# Altium schematic sheet schematic_flashlight.SchDoc
size A; SheetNumber: 1; SheetTotal: 1
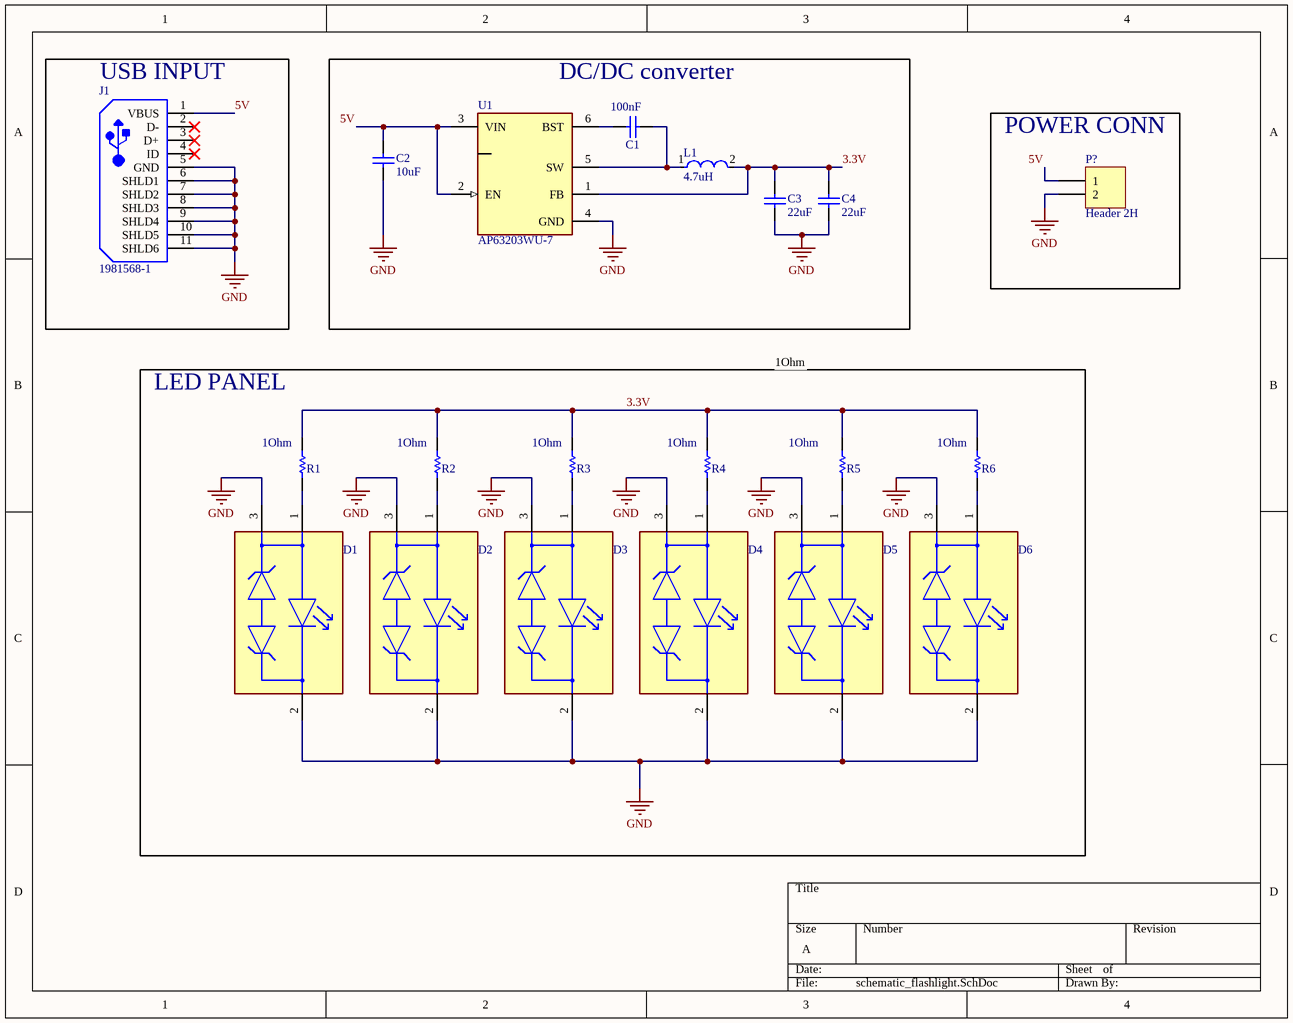
[diagram p0: schematic_flashlight.SchDoc]

## Parts
C1  100nF  [CAPC2013X145X50LL20T25]
C2  10uF  [CAPC2013X145X50LL20T25]
C3  22uF  [CAPC2013X145X50LL20T25]
C4  22uF  [CAPC2013X145X50LL20T25]
D1  SML-LXL8047USBCTR3  [FP-SML-LXL8047USBCTR3-MFG]  (value not drawn)
D2  SML-LXL8047USBCTR3  [FP-SML-LXL8047USBCTR3-MFG]  (value not drawn)
D3  SML-LXL8047USBCTR3  [FP-SML-LXL8047USBCTR3-MFG]  (value not drawn)
D4  SML-LXL8047USBCTR3  [FP-SML-LXL8047USBCTR3-MFG]  (value not drawn)
D5  SML-LXL8047USBCTR3  [FP-SML-LXL8047USBCTR3-MFG]  (value not drawn)
D6  SML-LXL8047USBCTR3  [FP-SML-LXL8047USBCTR3-MFG]  (value not drawn)
J1  1981568-1  [TECO-1981568-5_V]
L1  4.7uH  [FP-NR6028-MFG]
P?  Header 2H  [HDR1X2H]
R1  1Ohm  [RESC3216X60X45LL10T20]
R2  1Ohm  [RESC3216X60X45LL10T20]
R3  1Ohm  [RESC3216X60X45LL10T20]
R4  1Ohm  [RESC3216X60X45LL10T20]
R5  1Ohm  [RESC3216X60X45LL10T20]
R6  1Ohm  [RESC3216X60X45LL10T20]
U1  AP63203WU-7  [FP-TSOT26-MFG]

## Blocks framed on the sheet
USB INPUT: J1
DC/DC converter: C1-C4 L1 U1
POWER CONN: P?
LED PANEL: D1-D6 R1-R6

## Nets
GND: C2.1 C3.1 C4.1 D1.2(C) D1.3(SLUG) D2.2(C) D2.3(SLUG) D3.2(C) D3.3(SLUG) D4.2(C) D4.3(SLUG) D5.2(C) D5.3(SLUG) D6.2(C) D6.3(SLUG) J1.5(GND) J1.6(SHLD1) J1.7(SHLD2) J1.8(SHLD3) J1.9(SHLD4) J1.10(SHLD5) J1.11(SHLD6) P?.2 U1.4(GND)
3.3V: C3.2 C4.2 L1.2 R1.2 R2.2 R3.2 R4.2 R5.2 R6.2 U1.1(FB)
5V: C2.2 J1.1(VBUS) P?.1 U1.2(EN) U1.3(VIN)
NetC1_1: C1.1 L1.1 U1.5(SW)
NetC1_2: C1.2 U1.6(BST)
NetD1_1: D1.1(A) R1.1
NetD2_1: D2.1(A) R2.1
NetD3_1: D3.1(A) R3.1
NetD4_1: D4.1(A) R4.1
NetD5_1: D5.1(A) R5.1
NetD6_1: D6.1(A) R6.1

Not connected (* = marked no-connect by the designer): J1 2(D-)* 3(D+)* 4(ID)*

## Notes on the sheet
- 1Ohm

## Library data of the parts
C1-C4 = CMP-1036-04746-2: Manufacturer: Kemet; Part Number: C0805C105K4PACTU
D1-D6 = CMP-57192-000008-1: LED ROUND 3W BLUE 448NM SMD; Luminous Intensity: 20mcd; Current Rating: 1.5A; Test Temperature: 25°C; Forward Current: 700mA; Forward Voltage: 4.6V; Wavelength: 454nm; Approvals: UL; Number of LEDs: 1; Viewing Angle: 100°; Lens Style: Dome; Luminous Flux: 20lm; Series: TitanBrite™; Lens Color: Blue; Min Operating Temperature: -40°C; Case/Package: SMD/SMT; Number of Pins: 2; RoHS Compliant: Yes; Illumination Color: Blue; Max Power Dissipation: 3W; Max Operating Temperature: 100°C; Packaging: Tape and Reel; Dominant Wavelength: 454nm; Color: Blue; REACH SVHC: No SVHC; Test Current: 700mA; Power Rating: 3W; Operating Supply Voltage: 4.6V; Max Current Rating: 700mA; Package Quantity: 1; Mount: Surface Mount
J1 = CMP-2000-05408-1: Micro USB Receptacle Standard Type B Assy, 5-Pin SMD, RoHS, Tape and Reel; Manufacturer: TE Connectivity; Body Orientation: RightAngle; Number of Ports: 1Port; Number of Contacts: 5POS; Gender: RCP; Voltage Rating Max: 30VAC; Product Depth (mm): 5.6mm; Pitch (mm): 0.65mm; Current Rating (Max): 1/ContactA; Product Length (mm): 8mm; Product Height (mm): 3mm; Operating Temperature Max Deg. C: 85C; Datasheet URL: http://www.mouser.com/ds/2/418/NG_CD_1981568_E2-621296.pdf; Termination Method: Solder; Number of Terminals: 5; Operating Temp Range: -55Cto85C; Mounting Style: SurfaceMount; Manufacturer URL: http://www.te.com/; Contact Material: CopperAlloy; Packaging: TapeandReel; Datasheet Version: Rev. E2, 08/2015; Operating Temperature Min Deg. C: -55C; Housing Material: Thermoplastic; Type: MicroUSB; Contact Plating: GoldOverNickel
L1 = CMP-14484-000406-1: SMD Power Inductors 10uH ±20% 1.9A 84.5mΩ; Core Material: Ferrite; Self Resonant Frequency: 20MHz; Test Frequency: 100kHz; DC Resistance (DCR): 84.5mR; Shielding: Shielded; Current Rating: 1.9A; Package Quantity: 2000; Tolerance: 20%; Saturation Current: 1.9A; Max Operating Temperature: 120°C; Case/Package: 2424; Number of Pins: 2; Lead Free: Lead Free; Series: NR; Inductance Tolerance: 20%; RMS Current (Irms): 1.9A; Max DC Current: 1.9A; Resistor Type: Wirewound; Min Operating Temperature: -25°C; Width: 6mm; Height - Seated (Max): 0.11inch; RoHS Compliant: Yes; Mount: Surface Mount; Packaging: Tape and Reel; Inductance: 10uH; Length: 0.236inch; Halogen Free: Halogen Free; Height: 2.8mm; Termination: SMD/SMT
P? = Header 2H: Header, 2-Pin, Right Angle; LatestRevisionDate: 17-Jul-2002; LatestRevisionNote: Re-released for DXP Platform.; Publisher: Altium Limited
R1-R6 = CMP-2003-01921-1: Manufacturer: Vishay Dale; Part Number: CRCW12061R00FNEA
U1 = CMP-12757-000006-1: IC REG BUCK 3.3V 2A TSOT26; Manufacturer: Diodes Inc.; Description: Buck Switching Regulator IC Positive Fixed 3.3V 1 Output 2A SOT-23-6 Thin, TSOT-23-6; Output Type: Fixed; Min Supply Voltage: 3.8V; Number Of Outputs: 1; Max Junction Temp: +160°C; Nominal Supply Current: 22uA; Standoff Height: 0.01mm; Switching Frequency: 1.1MHz; Max Supply Voltage: 32V; ComponentLink2Description: Datasheet; Device Class L1: Integrated Circuits (ICs); Temperature: to +160°C; Device Class L3: Voltage Regulators - Switching; RoHS: TRUE; Octopart: https://octopart.com/ap63203wu-7-diodes+inc.-98099550; Output Voltage: 3.3V; Lead Free: Yes; ComponentLink2URL: https://www.diodes.com/assets/Datasheets/AP63200-AP63201-AP63203-AP63205.pdf; Digikey Description: IC REG BUCK 3.3V 2A TSOT26; Footprint Url: https://www.diodes.com/assets/Package-Files/TSOT26.pdf; Ambient Temperature Range High: +85°C; Height: 1mm; Automotive: No; Temperature Range High: +160°C; Switching Topology: Buck; Output Current: 2A; Package: TSOT26; Category: IC; Mouser Description: AP63203 Series 3.3 V 2 A SMT Fixed Low IQ Synchronous Buck - TSOT-26; Device Class L2: Power Management ICs; Ambient Temperature Range Low: -40°C; Manufacturer Part Number: AP63203WU-7